# EAGLE design L293D (EAGLE 7.7.0)
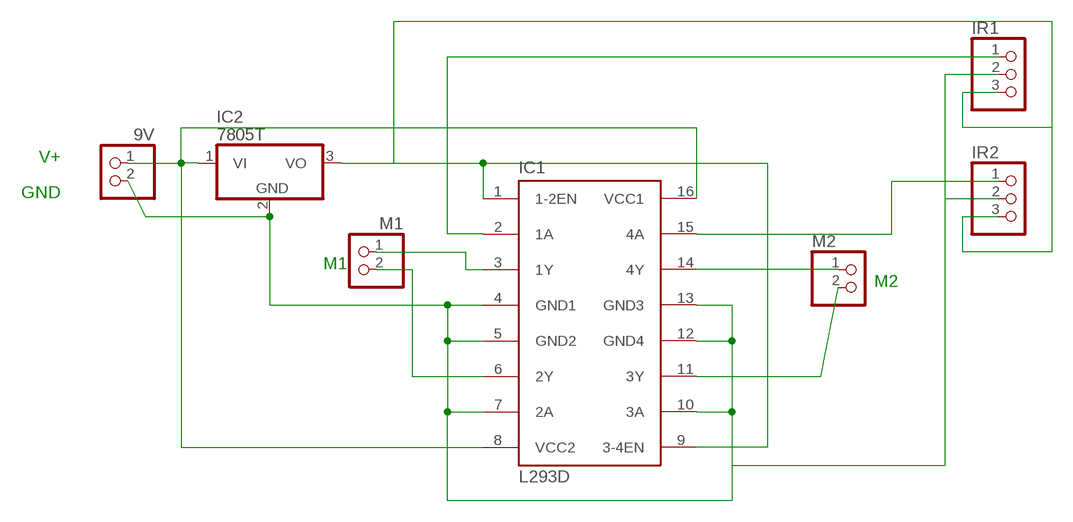
[diagram p0: schematic, sheet 1]

## Parts
9V  PINHD-1X2  [1X02]
IC1  L293D  [DIL16]
IC2  7805T  [TO220H]
IR1  PINHD-1X3  [1X03]
IR2  PINHD-1X3  [1X03]
M1  PINHD-1X2  [1X02]
M2  PINHD-1X2  [1X02]

## Nets
N$1: IC1.1(1-2EN) IC1.9(3-4EN) IC2.3(VO) IR1.3 IR2.3
N$2: 9V.2 IC1.4(GND1) IC1.5(GND2) IC1.7(2A) IC1.10(3A) IC1.12(GND4) IC1.13(GND3) IC2.2(GND) IR1.2 IR2.2
N$3: IC1.6(2Y) M1.2
N$4: IC1.14(4Y) M2.1
N$5: IC1.3(1Y) M1.1
N$6: IC1.11(3Y) M2.2
N$7: IC1.2(1A) IR1.1
N$8: IC1.15(4A) IR2.1
N$9: 9V.1 IC1.8(VCC2) IC1.16(VCC1) IC2.1(VI)

## Notes on the sheet
- V+
- GND
- M1
- M2

## Library data of the parts
9V M1 M2 = pinhead_1x14_no_frame:PINHD-1X2: PIN HEADER
IC1 = st-microelectronics:L293D: PUSH-PULL 4 CHANNEL DRIVER; MPN: L293D; OC_FARNELL: 9589619; OC_NEWARK: 56P8249
IC2 = adafruit:78*: Positive VOLTAGE REGULATOR Added bigger pads to the TO-92 package
IR1 IR2 = pinhead:PINHD-1X3: PIN HEADER

## Board
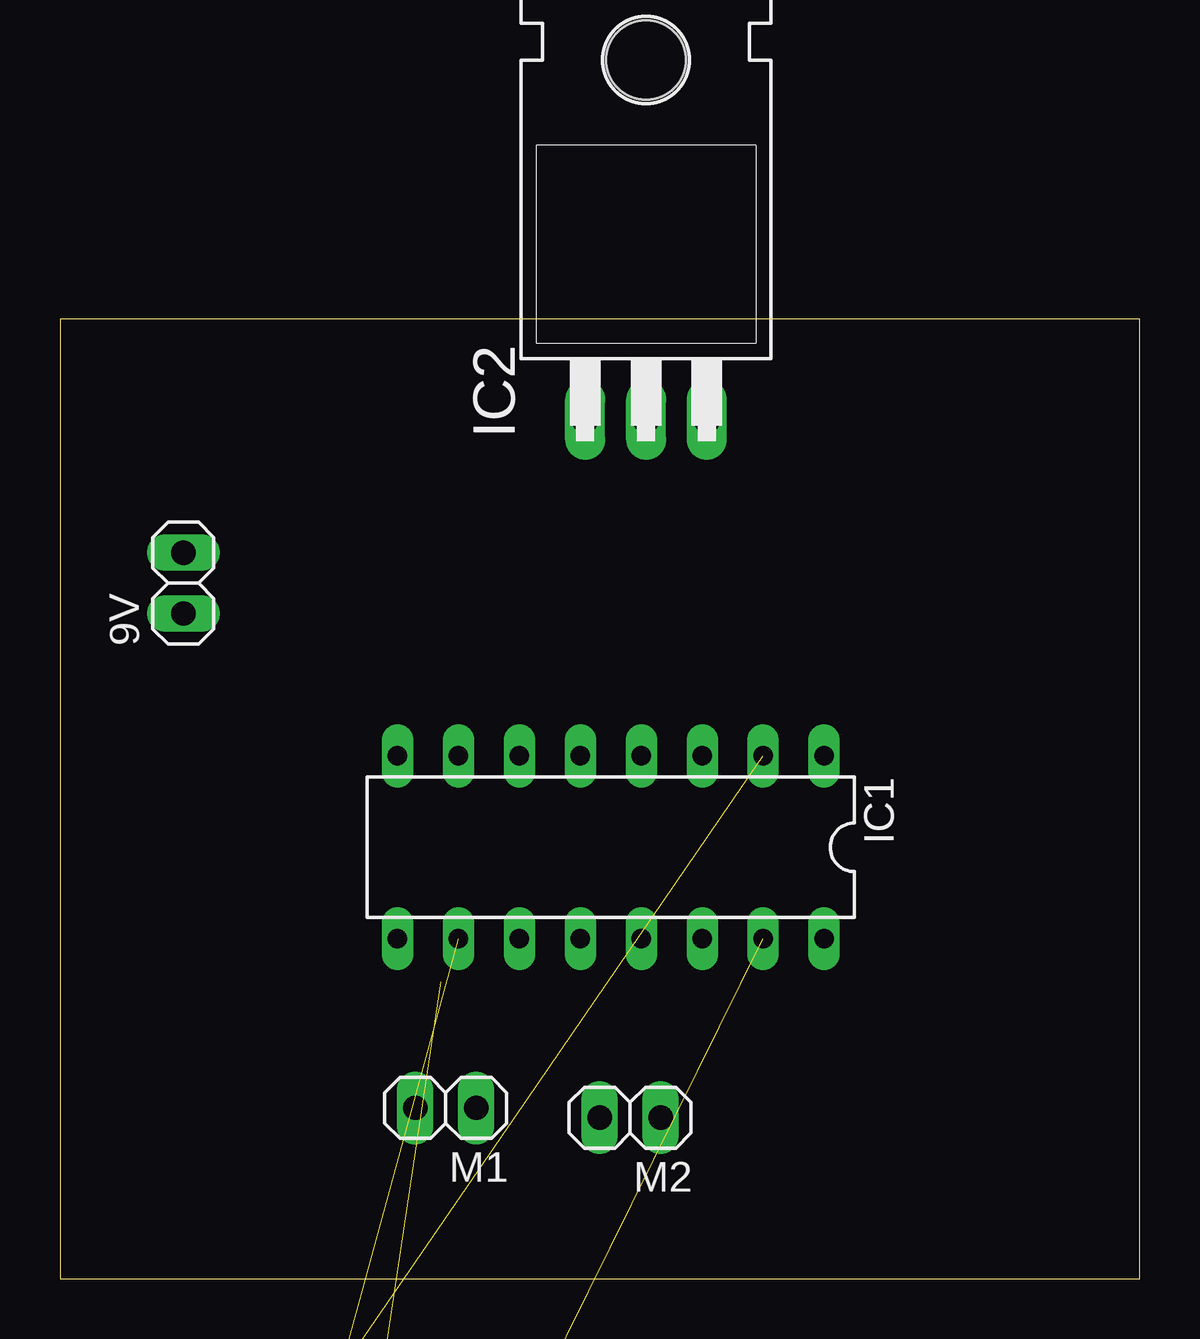
[diagram p1: board, top side]
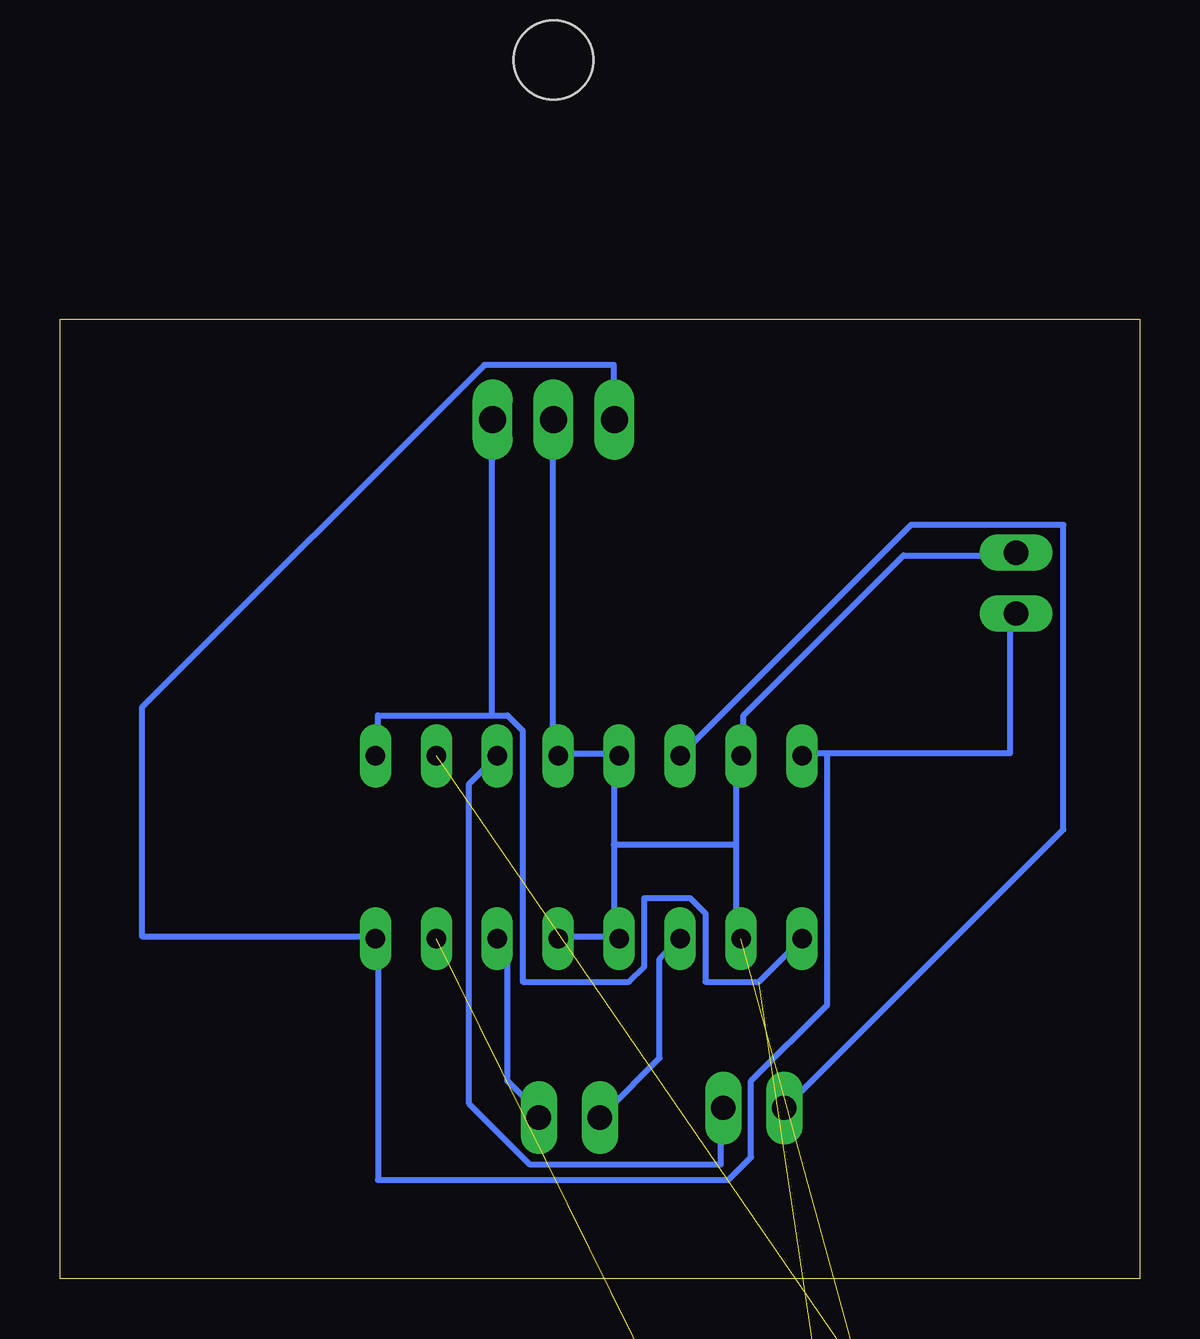
[diagram p2: board, bottom side, seen from below]

Size 45 x 40 mm. Coordinates in mm from the lower left corner, seen from the top.
Outline: 0,0 45,0 45,40 0,40 0,0
Copper layers (1*16): Top 0.035mm / dielectric 1.5mm / Bottom 0.035mm
Design rules "default": minimum track width 10mil, minimum drill 24mil, track to track 8mil, track to pad 8mil, pad to pad 8mil, via to via 8mil, smd to smd 8mil, copper to edge 40mil, drill to drill 8mil, minimum pad ring 10mil, minimum via ring 8mil, stop-mask expansion 4mil, vias tented up to drill 0mil, thermal gap 10mil

### Footprints (pad centres in the part's own frame; a part is rotated, then mirrored left to right if it is on the bottom)
1X02 = drill 1.016 long: 1 -1.27,0; 2 1.27,0
DIL16 = drill 0.813 long: 1 -8.89,-3.81; 2 -6.35,-3.81; 3 -3.81,-3.81; 4 -1.27,-3.81; 5 1.27,-3.81; 6 3.81,-3.81; 7 6.35,-3.81; 8 8.89,-3.81; 9 8.89,3.81; 10 6.35,3.81; 11 3.81,3.81; 12 1.27,3.81; 13 -1.27,3.81; 14 -3.81,3.81; 15 -6.35,3.81; 16 -8.89,3.81
TO220H = drill 1.118 long: 1 -2.54,-10.16; 2 0,-10.16; 3 2.54,-10.16 | hole 3.302: 0,4.826
1X03 = drill 1.016 long: 1 -2.54,0; 2 0,0; 3 2.54,0

### Placement (x,y rotation side)
9V  5.14,29 90 top
IC1  22.96,17.99 180 top
IC2  24.43,45.98 0 top
IR1  10,-10 0 top  (outside the outline)
IR2  10,-30 0 top  (outside the outline)
M1  16.08,7.13 180 top
M2  23.76,6.72 180 top

### Tracks (layer width: path | path; a pad name or v marks a point on that pad's centre or on a via)
N$1  (2 unrouted)
  Bottom 0.254: 26.99,23.5 31.75,23.5 31.75,21.91 IC1.1 | 26.99,23.5 26.35,23.5 25.72,22.86 25.72,12.38 21.27,12.38 20.64,13.02 20.64,15.88 18.73,15.88 18.1,15.24 18.1,12.38 15.88,12.38 14.29,13.97 IC1.9 | 26.99,23.5 26.99,35.56 IC2.3
N$2  (2 unrouted)
  Bottom 0.254: 21.91,14.29 24.13,14.29 IC1.13 | IC2.2 24.45,35.56 24.45,21.91 IC1.4 24.13,21.91 21.91,21.91 IC1.5 21.91,21.59 21.91,18.1 | 21.91,18.1 21.91,14.29 | 21.91,14.29 IC1.12 | 16.83,18.1 16.83,21.59 IC1.7 16.51,21.91 16.51,23.5 9.84,30.16 5.4,30.16 9V.2 | 16.83,18.1 16.83,14.29 IC1.10 | 16.83,18.1 21.91,18.1
N$3
  Bottom 0.254: IC1.6 19.05,21.91 9.53,31.43 3.17,31.43 3.17,18.73 14.61,7.3 M1.2
N$4
  Bottom 0.254: IC1.14 26.67,13.97 26.35,13.65 26.35,8.26 25.08,6.99 M2.1
N$5
  Bottom 0.254: IC1.3 26.99,21.59 27.94,20.64 27.94,7.3 25.4,4.76 17.46,4.76 17.46,6.99 M1.1
N$6
  Bottom 0.254: IC1.11 19.37,13.97 20,13.34 20,9.21 22.23,6.99 M2.2
N$7  (1 unrouted)
N$8  (1 unrouted)
N$9
  Bottom 0.254: 13.02,21.91 5.4,21.91 5.4,27.62 9V.1 | 13.02,21.91 13.97,21.91 IC1.8 | IC2.1 21.91,35.88 21.91,38.1 27.3,38.1 41.59,23.81 41.59,14.29 32.07,14.29 IC1.16 31.75,13.97 31.75,4.13 17.14,4.13 16.19,5.08 16.19,8.26 13.02,11.43 13.02,21.91